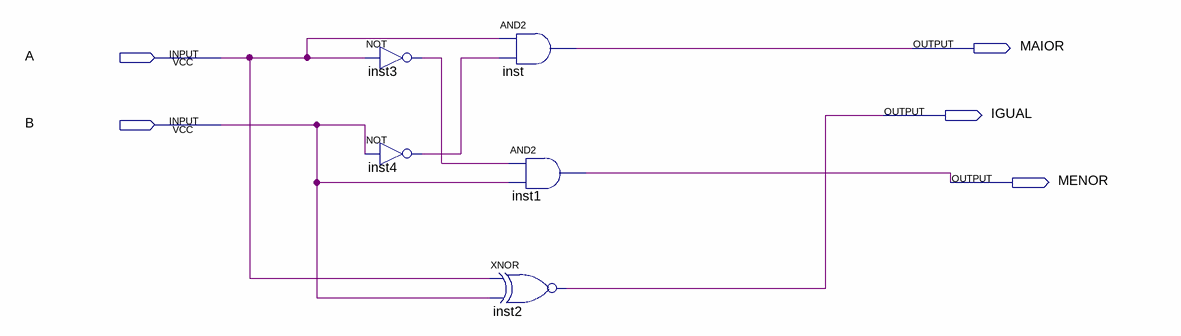
[diagram p0: schematic sheet]
// Quartus schematic comparador1bit.bdf as structural Verilog: 5 symbols, 5 pins
module comparador1bit (
  input  A,
  input  B,
  output MAIOR,
  output IGUAL,
  output MENOR
);

  wire inst3_out, inst4_out;

  not inst3 (inst3_out, A);
  not inst4 (inst4_out, B);
  and inst (MAIOR, A, inst4_out);
  and inst1 (MENOR, inst3_out, B);
  xnor inst2 (IGUAL, A, B);
endmodule
